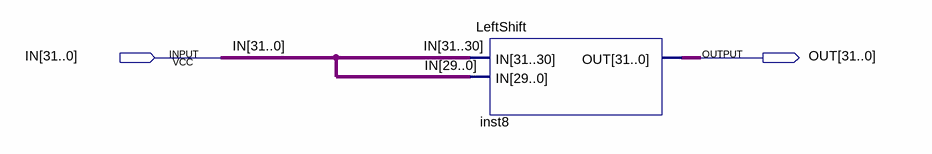
[diagram p0: schematic sheet]
// Quartus schematic LeftShiftPro.bdf as structural Verilog: 1 symbols, 2 pins
module LeftShiftPro (
  input  [31:0] IN,
  output [31:0] OUT
);

  LeftShift inst8 (.IN(IN), .OUT(OUT));
endmodule
